# EAGLE design PSPS_AVNC_MITCH_2021-02-25 (EAGLE 9.6.2)

## Sheet 1 of 2
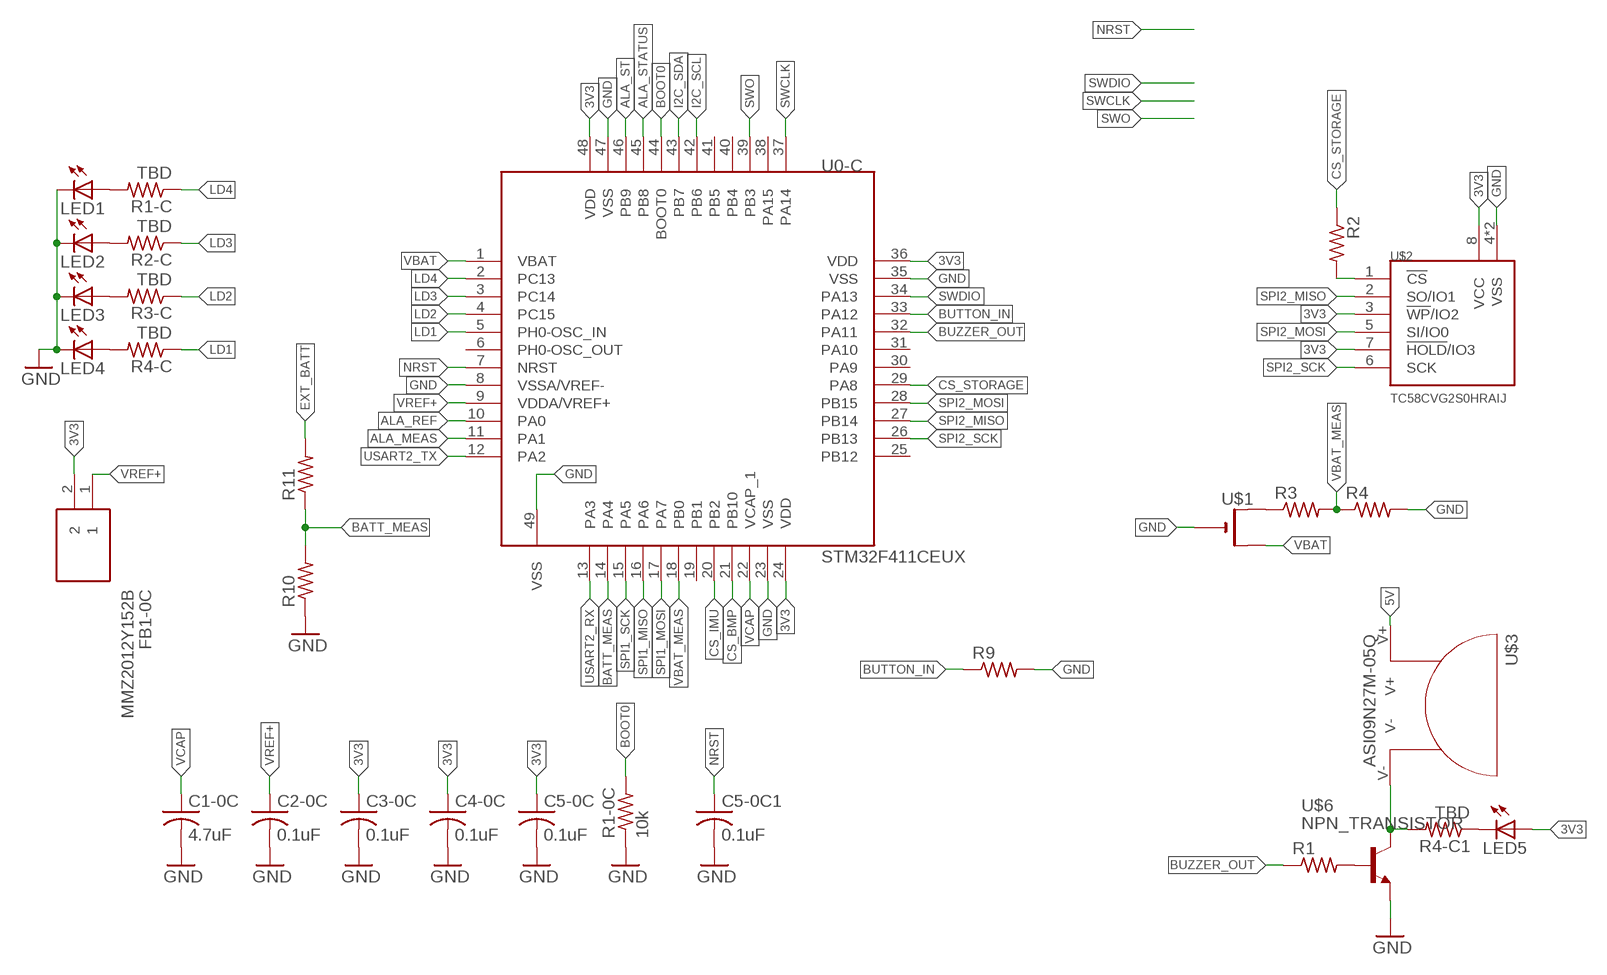
[diagram p0: schematic, sheet 1]

### Parts
C1-0C  4.7uF  C-USC0805  [C0805]
C2-0C  0.1uF  C-USC0805  [C0805]
C3-0C  0.1uF  C-USC0805  [C0805]
C4-0C  0.1uF  C-USC0805  [C0805]
C5-0C  0.1uF  C-USC0805  [C0805]
C5-0C1  0.1uF  C-USC0805  [C0805]
FB1-0C  MMZ2012Y152B  [BEADC2012X105N]
LED1  LEDCHIPLED_0805  [CHIPLED_0805]
LED2  LEDCHIPLED_0805  [CHIPLED_0805]
LED3  LEDCHIPLED_0805  [CHIPLED_0805]
LED4  LEDCHIPLED_0805  [CHIPLED_0805]
LED5  LEDCHIPLED_0805  [CHIPLED_0805]
R1  R-US_R0805  [R0805]
R1-0C  10k  R-US_R0805  [R0805]
R1-C  TBD  R-US_R0805  [R0805]
R2  R-US_R0805  [R0805]
R2-C  TBD  R-US_R0805  [R0805]
R3  R-US_R0805  [R0805]
R3-C  TBD  R-US_R0805  [R0805]
R4  R-US_R0805  [R0805]
R4-C  TBD  R-US_R0805  [R0805]
R4-C1  TBD  R-US_R0805  [R0805]
R9  R-US_R0805  [R0805]
R10  R-US_R0805  [R0805]
R11  R-US_R0805  [R0805]
U0-C  STM32F411CEUX  [QFN50P700X700X50-49T560N]
U$1  CR1220SMT  [CR1220-SMD]
U$2  TC58CVG2S0HRAIJ  [SON127P800X600X80-9T350X440N]
U$3  ASI09N27M-05Q  [ASI09N27M-05Q]
U$6  NPN_TRANSISTOR  [SOT23]

### Nets
3V3: C3-0C.1 C4-0C.1 C5-0C.1 FB1-0C.2 LED5.A U0-C.24(VDD) U0-C.36(VDD) U0-C.48(VDD) U$2.3(!WP!/IO2) U$2.7(!HOLD!/IO3) U$2.8(VCC) ; also sheet 2
5V: U$3.V+ ; also sheet 2
ALA_MEAS: U0-C.11(PA1) ; also sheet 2
ALA_REF: U0-C.10(PA0) ; also sheet 2
ALA_ST: U0-C.46(PB9) ; also sheet 2
ALA_STATUS: U0-C.45(PB8) ; also sheet 2
BATT_MEAS: R10.2 R11.1 U0-C.14(PA4)
BOOT0: R1-0C.2 U0-C.44(BOOT0)
BUTTON_IN: R9.1 U0-C.33(PA12)
BUZZER_OUT: R1.1 U0-C.32(PA11)
CS_BMP: U0-C.21(PB10) ; also sheet 2
CS_IMU: U0-C.20(PB2) ; also sheet 2
CS_STORAGE: R2.1 U0-C.29(PA8)
CS_STORAGE-VIA: R2.2 U$2.1(!CS!)
EXT_BATT: R11.2
GND: C1-0C.2 C2-0C.2 C3-0C.2 C4-0C.2 C5-0C1.2 C5-0C.2 LED1.C LED2.C LED3.C LED4.C R1-0C.1 R4.2 R9.2 R10.1 U0-C.8(VSSA/VREF-) U0-C.23(VSS) U0-C.35(VSS) U0-C.47(VSS) U0-C.49(VSS) U$1.- U$2.4(VSS) U$2.9(VSS) U$6.3(E) ; also sheet 2
I2C_SCL: U0-C.42(PB6)
I2C_SDA: U0-C.43(PB7)
LD1: R4-C.1 U0-C.5(PH0-OSC_IN)
LD2: R3-C.1 U0-C.4(PC15)
LD3: R2-C.1 U0-C.3(PC14)
LD4: R1-C.1 U0-C.2(PC13)
N$1: R1.2 U$6.1(B)
N$2: LED4.A R4-C.2
N$3: LED3.A R3-C.2
N$4: LED2.A R2-C.2
N$5: LED1.A R1-C.2
N$10: R3.1 U$1.+$1(+)
N$11: R4-C1.2 U$3.V- U$6.2(C)
N$14: LED5.C R4-C1.1
NRST: C5-0C1.1 U0-C.7(NRST)
SPI1_MISO: U0-C.16(PA6) ; also sheet 2
SPI1_MOSI: U0-C.17(PA7) ; also sheet 2
SPI1_SCK: U0-C.15(PA5) ; also sheet 2
SPI2_MISO: U0-C.27(PB14) U$2.2(SO/IO1)
SPI2_MOSI: U0-C.28(PB15) U$2.5(SI/IO0)
SPI2_SCK: U0-C.26(PB13) U$2.6(SCK)
SWCLK: U0-C.37(PA14)
SWDIO: U0-C.34(PA13)
SWO: U0-C.39(PB3)
USART2_RX: U0-C.13(PA3) ; also sheet 2
USART2_TX: U0-C.12(PA2) ; also sheet 2
VBAT: U0-C.1(VBAT) U$1.+$2(+1) ; also sheet 2
VBAT_MEAS: R3.2 R4.1 U0-C.18(PB0)
VCAP: C1-0C.1 U0-C.22(VCAP_1)
VREF+: C2-0C.1 FB1-0C.1 U0-C.9(VDDA/VREF+)
Unconnected: U0-C.6(PH0-OSC_OUT) U0-C.19(PB1) U0-C.25(PB12) U0-C.30(PA9) U0-C.31(PA10) U0-C.38(PA15) U0-C.40(PB4) U0-C.41(PB5)

## Sheet 2 of 2
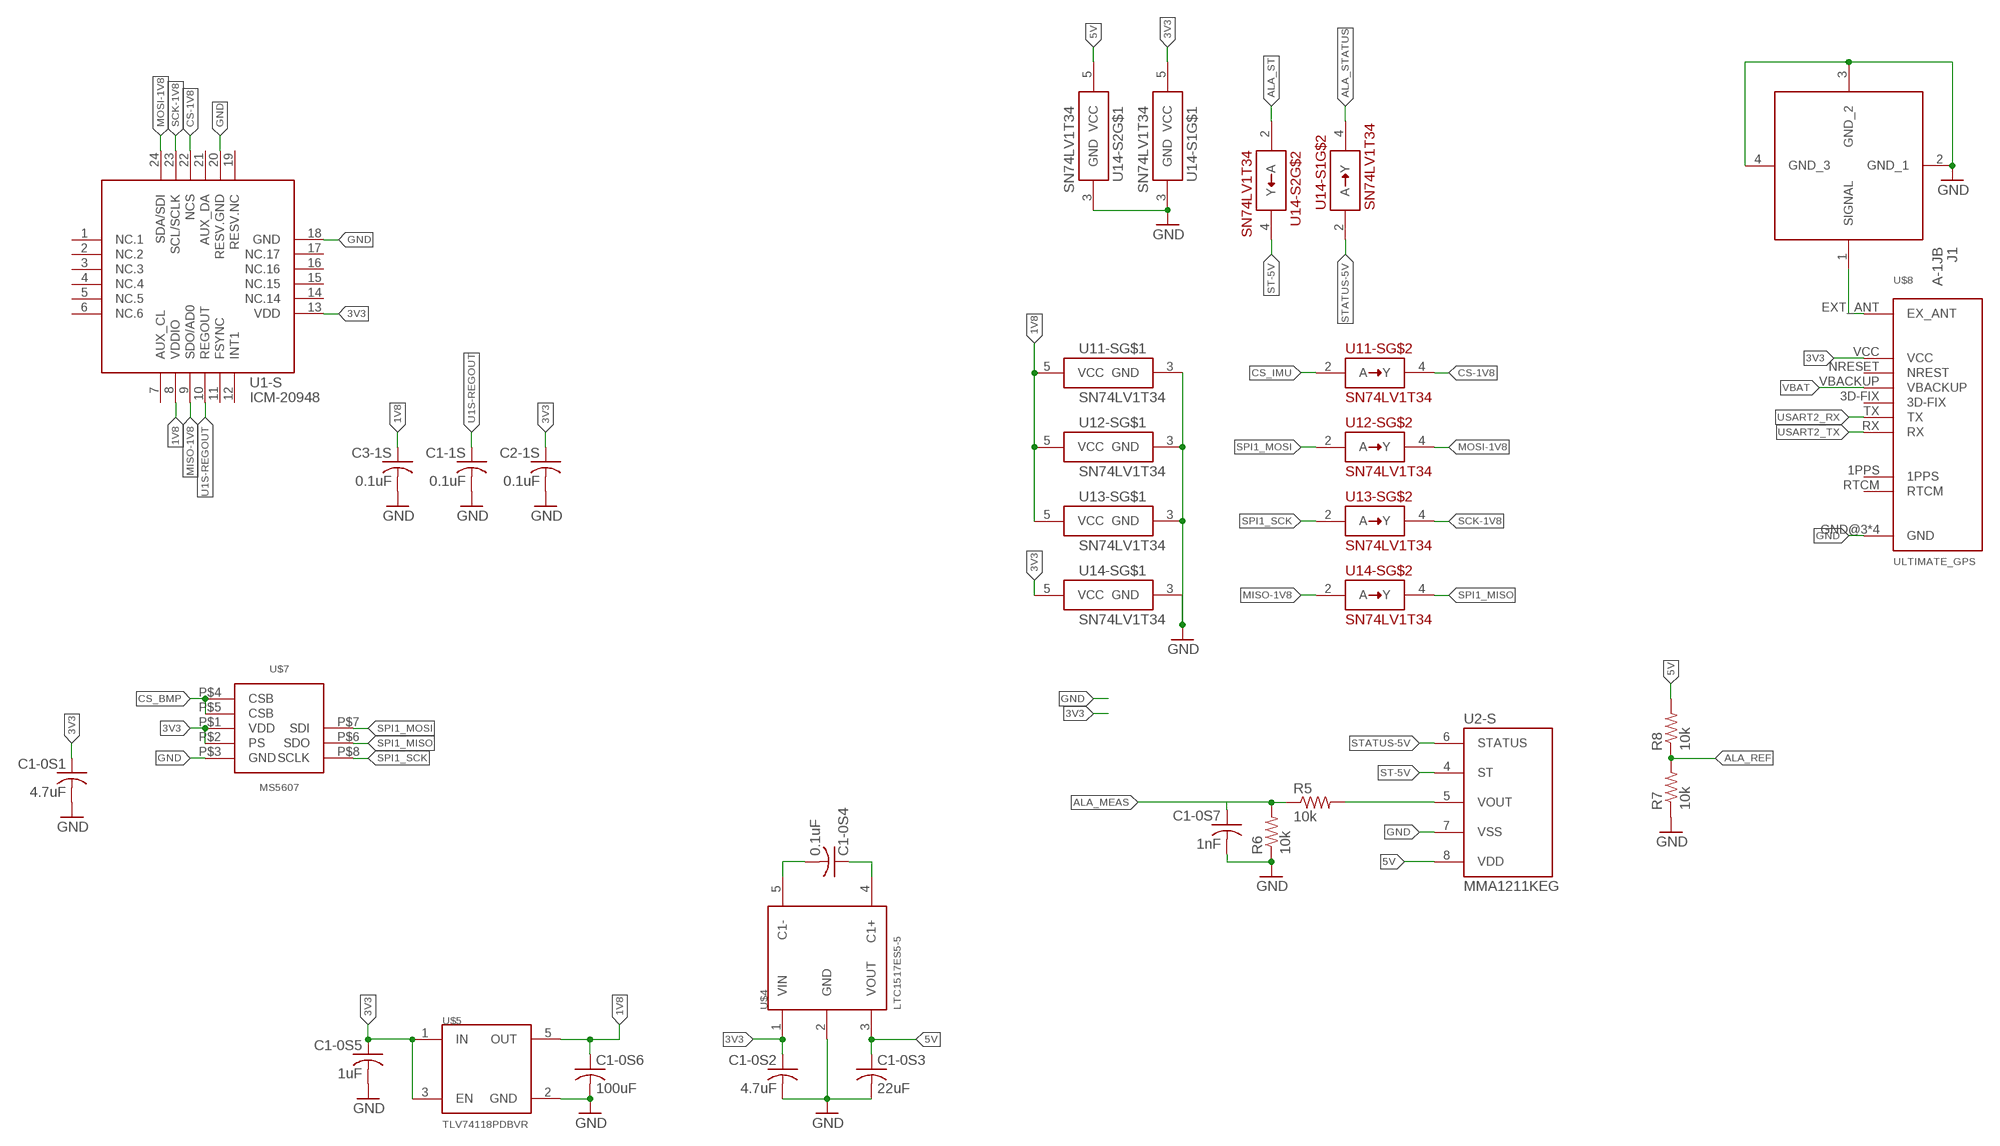
[diagram p1: schematic, sheet 2]

### Parts
C1-0S1  4.7uF  C-USC0805  [C0805]
C1-0S2  4.7uF  C-USC0805  [C0805]
C1-0S3  22uF  C-USC0805  [C0805]
C1-0S4  0.1uF  C-USC0805  [C0805]
C1-0S5  1uF  C-USC0805  [C0805]
C1-0S6  100uF  C-USC0805  [C0805]
C1-0S7  1nF  C-USC0805  [C0805]
C1-1S  0.1uF  C-USC0805  [C0805]
C2-1S  0.1uF  C-USC0805  [C0805]
C3-1S  0.1uF  C-USC0805  [C0805]
J1  A-1JB  [A1JB]
R5  10k  R-US_R0805  [R0805]
R6  10k  R-US_R0805  [R0805]
R7  10k  R-US_R0805  [R0805]
R8  10k  R-US_R0805  [R0805]
U1-S  ICM-20948  [QFN40P300X300X105-25T159X175]
U2-S  MMA1211KEG  [SOIC127P1041X355-16N]
U11-S  SN74LV1T34  [SOT65P210X110-5]
U12-S  SN74LV1T34  [SOT65P210X110-5]
U13-S  SN74LV1T34  [SOT65P210X110-5]
U14-S  SN74LV1T34  [SOT65P210X110-5]
U14-S1  SN74LV1T34  [SOT65P210X110-5]
U14-S2  SN74LV1T34  [SOT65P210X110-5]
U$4  LTC1517ES5-5  [SOT95P280X145-5N]
U$5  TLV74118PDBVR  [SOT95P280X145-5N]
U$7  MS5607  [MS5607]
U$8  ULTIMATE_GPS  [FGPMMOPA6H]

### Nets
1V8: C1-0S6.1 C3-1S.1 U1-S.8(VDDIO) U11-S.5(VCC) U12-S.5(VCC) U13-S.5(VCC) U$5.5(OUT)
3V3: C1-0S1.1 C1-0S2.1 C1-0S5.1 C2-1S.1 U1-S.13(VDD) U14-S1.5(VCC) U14-S.5(VCC) U$4.1(VIN) U$5.1(IN) U$5.3(EN) U$7.P$1(VDD) U$7.P$2(PS) U$8.VCC ; also sheet 1
5V: C1-0S3.1 R8.2 U2-S.8(VDD) U14-S2.5(VCC) U$4.3(VOUT) ; also sheet 1
ALA_MEAS: C1-0S7.1 R5.1 R6.2 ; also sheet 1
ALA_REF: R7.2 R8.1 ; also sheet 1
ALA_ST: U14-S2.2(A) ; also sheet 1
ALA_STATUS: U14-S1.4(Y) ; also sheet 1
CS-1V8: U1-S.22(NCS) U11-S.4(Y)
CS_BMP: U$7.P$4(CSB) U$7.P$5(CSB) ; also sheet 1
CS_IMU: U11-S.2(A) ; also sheet 1
GND: C1-0S1.2 C1-0S2.2 C1-0S3.2 C1-0S5.2 C1-0S6.2 C1-0S7.2 C1-1S.2 C2-1S.2 C3-1S.2 J1.2(GND_1) J1.3(GND_2) J1.4(GND_3) R6.1 R7.1 U1-S.18(GND) U1-S.20(RESV.GND) U2-S.7(VSS) U11-S.3(GND) U12-S.3(GND) U13-S.3(GND) U14-S1.3(GND) U14-S2.3(GND) U14-S.3(GND) U$4.2(GND) U$5.2(GND) U$7.P$3(GND) U$8.GND@3(GND) U$8.GND@8(GND) U$8.GND@12(GND) U$8.GND@19(GND) ; also sheet 1
MISO-1V8: U1-S.9(SDO/AD0) U14-S.2(A)
MOSI-1V8: U1-S.24(SDA/SDI) U12-S.4(Y)
N$12: C1-0S4.1 U$4.4(C1+)
N$13: C1-0S4.2 U$4.5(C1-)
N$15: J1.1(SIGNAL) U$8.EXT_ANT(EX_ANT)
N$16: R5.2 U2-S.5(VOUT)
SCK-1V8: U1-S.23(SCL/SCLK) U13-S.4(Y)
SPI1_MISO: U14-S.4(Y) U$7.P$6(SDO) ; also sheet 1
SPI1_MOSI: U12-S.2(A) U$7.P$7(SDI) ; also sheet 1
SPI1_SCK: U13-S.2(A) U$7.P$8(SCLK) ; also sheet 1
ST-5V: U2-S.4(ST) U14-S2.4(Y)
STATUS-5V: U2-S.6(STATUS) U14-S1.2(A)
U1S-REGOUT: C1-1S.1 U1-S.10(REGOUT)
USART2_RX: U$8.TX ; also sheet 1
USART2_TX: U$8.RX ; also sheet 1
VBAT: U$8.VBACKUP ; also sheet 1
Unconnected: U1-S.1(NC.1) U1-S.2(NC.2) U1-S.3(NC.3) U1-S.4(NC.4) U1-S.5(NC.5) U1-S.6(NC.6) U1-S.7(AUX_CL) U1-S.11(FSYNC) U1-S.12(INT1) U1-S.14(NC.14) U1-S.15(NC.15) U1-S.16(NC.16) U1-S.17(NC.17) U1-S.19(RESV.NC) U1-S.21(AUX_DA) U$8.1PPS U$8.3D-FIX U$8.NRESET(NREST) U$8.RTCM

## Library data of the parts
C1-0C C1-0S1-C1-0S7 C1-1S C2-0C C2-1S C3-0C C3-1S C4-0C C5-0C C5-0C1 = resistor:C-US: CAPACITOR, American symbol
FB1-0C = Computer2:MMZ2012Y152B: Ferrite bead SMD 1500Ohm 500mA TDK Ferrite Bead (Chip Bead), 2 x 1.25 x 0.85mm (0805) Source: Datasheet <https://componentsearchengine.com/Datasheets/1/MMZ2012Y152B.pdf>; DESCRIPTION: Ferrite bead SMD 1500Ohm 500mA TDK Ferrite Bead (Chip Bead), 2 x 1.25 x 0.85mm (0805); HEIGHT: 1.05mm; MANUFACTURER_NAME: TDK; MANUFACTURER_PART_NUMBER: MMZ2012Y152B; MOUSER_PART_NUMBER: 810-MMZ2012Y152B; MOUSER_PRICE-STOCK: https://www.mouser.com/Search/Refine.aspx?Keyword=810-MMZ2012Y152B
J1 = SamacSys_Parts:A-1JB: AMC Straight PCB Jack, Surface Mount Source: Datasheet <https://componentsearchengine.com/Datasheets/1/A-1JB.pdf>; DESCRIPTION: AMC Straight PCB Jack, Surface Mount; HEIGHT: 1.05mm; MANUFACTURER_NAME: Amphenol; MANUFACTURER_PART_NUMBER: A-1JB; MOUSER_PART_NUMBER: 523-A-1JB; MOUSER_PRICE-STOCK: https://www.mouser.com/Search/Refine.aspx?Keyword=523-A-1JB
LED1-LED5 = adafruit:LED: LED OSRAM: - CHIPLED LG R971, LG N971, LY N971, LG Q971, LY Q971, LO R971, LY R971 LH N974, LH R974 LS Q976, LO Q976, LY Q976 LO Q996 - Hyper CHIPLED LW Q18S LB Q993, LB Q99A, LB R99A - SideLED LS A670, LO A670, LY A670, LG A670, LP A670 LB A673, LV A673, LT A673, LW A673 LH A674 LY A675 LS A676, LA A676, LO A676, LY A676, LW A676 LS A679, LY A679, LG A679 - Hyper Micro SIDELED® LS Y876, LA Y876, LO Y876, LY Y876 LT Y87S - SmartLED LW L88C, LW L88S LB L89C, LB L89S, LG L890 LS L89K, LO L89K, LY L89K LS L896, LA L896, LO L896, LY L896 - TOPLED LS T670, LO T670, LY T670, LG T670, LP T670 LSG T670, LSP T670, LSY T670, LOP T670, LYG T670 LG T671, LOG T671, LSG T671 LB T673, LV T673, LT T673, LW T673 LH T674 LS T676, LA T676, LO T676, LY T676, LB T676, LH T676, LSB T676, LW T676 LB T67C, LV T67C, LT T67C, LS T67K, LO T67K, LY T67K, LW E67C LS E67B, LA E67B, LO E67B, LY E67B, LB E67C, LV E67C, LT E67C LW T67C LS T679, LY T679, LG T679 LS T770, LO T770, LY T770, LG T770, LP T770 LB T773, LV T773, LT T773, LW T773 LH T774 LS E675, LA E675, LY E675, LS T675 LS T776, LA T776, LO T776, LY T776, LB T776 LHGB T686 LT T68C, LB T68C - Hyper Mini TOPLED® LB M676 - Mini TOPLED Santana® LG M470 LS M47K, LO M47K, LY M47K Source: http://www.osram.convergy.de/
R1 R1-0C R1-C R2 R2-C R3 R3-C R4 R4-C R4-C1 R5-R11 = resistor:R-US_: RESISTOR, American symbol
U0-C = Computer2:STM32F411CEUX: STM32F411CEUx https://www.mouser.com/ProductDetail/STMicroelectronics/STM32F411CEU7/?qs=k5OWtXsTJaprF2FuhgNRlw%3D%3D
U1-S = Computer2:ICM-20948: 9 Axis Motion Sensor from TDK InvenSense https://store.invensense.com/products/detail/ICM20948-InvenSense/597203/
U2-S = Computer2:MMA1211KEG
U11-S U12-S U13-S U14-S U14-S1 U14-S2 = Computer2:SN74LV1T34: Single Power Supply BUFFER Logic Level Shifter
U$1 = adafruit:CR1220: CR1216/CR1220/CR1225 12mm 3V lithium coin cell Great for battery packup. Both SMT and THM holders. Note the THM package has the ground pads on both sides of the PCB so that the masks are the same - this reduces the cost
U$2 = Computer2:TC58CVG2S0HRAIJ: KIOXIA 4Gb 3.3V Serial Interface NAND Storage Chip https://www.mouser.com/ProductDetail/Kioxia-America/TC58CVG2S0HRAIJ/?qs=%2Fha2pyFadugZc7%252BD9PrBDvjJY1X%2FOab4zY0dVt2Ql9dEVkAi3P74yw%3D%3D
U$3 = Computer2:ASI09N27M-05Q
U$4 = Computer2:LTC1517ES5-5: Micropower, Regulated 5V Charge Pump in a 5-Pin SOT-23 Package https://www.mouser.com/ProductDetail/Analog-Devices/LTC1517ES5-5TRPBF/?qs=hVkxg5c3xu9WXQi7ay6esQ%3D%3D
U$5 = Computer2:TLV74118PDBVR: TLV741P 150-mA, Low-Dropout Regulator With Foldback Current Limit https://www.mouser.com/ProductDetail/Texas-Instruments/TLV74118PDBVR?qs=EU6FO9ffTwcK4Aqp8%2FfrLA%3D%3D
U$6 = Computer2:NPN_TRANSISTOR
U$7 = Computer2:MS5607
U$8 = Computer2:ULTIMATE_GPS

## Board
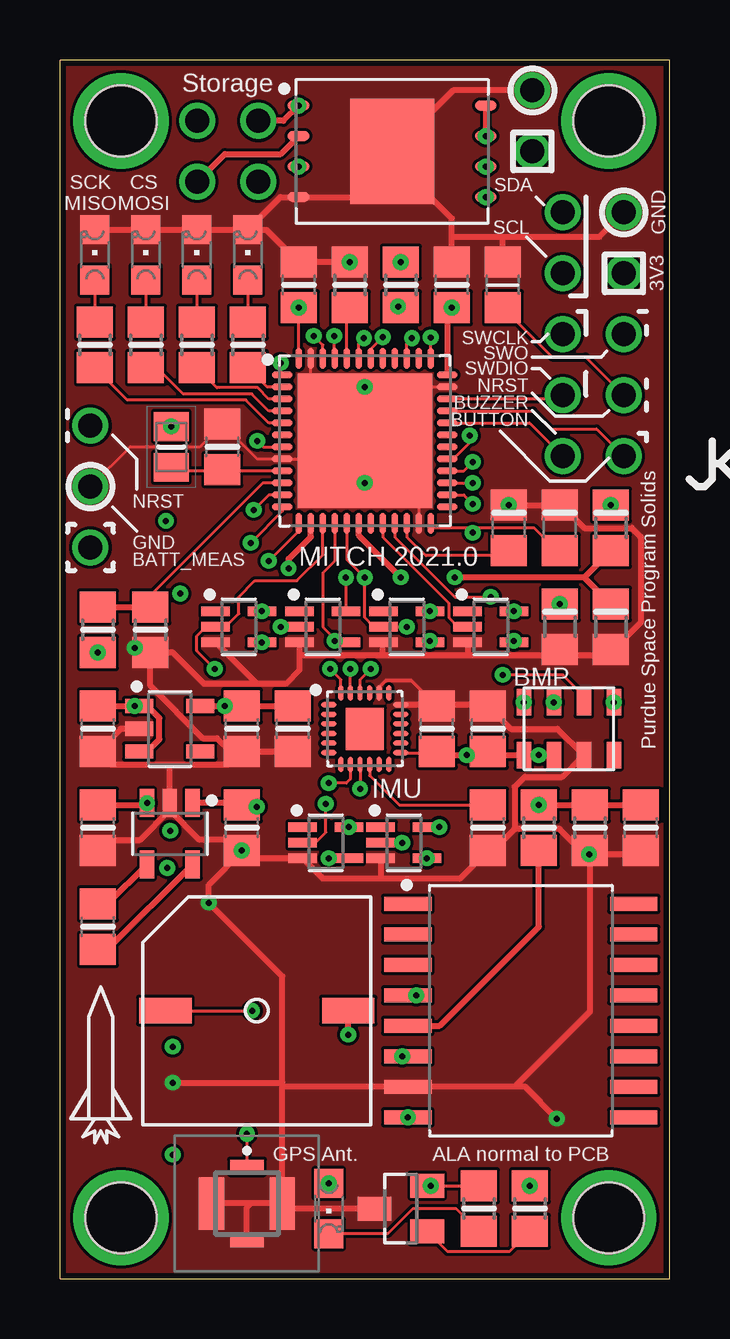
[diagram p2: board, top side]
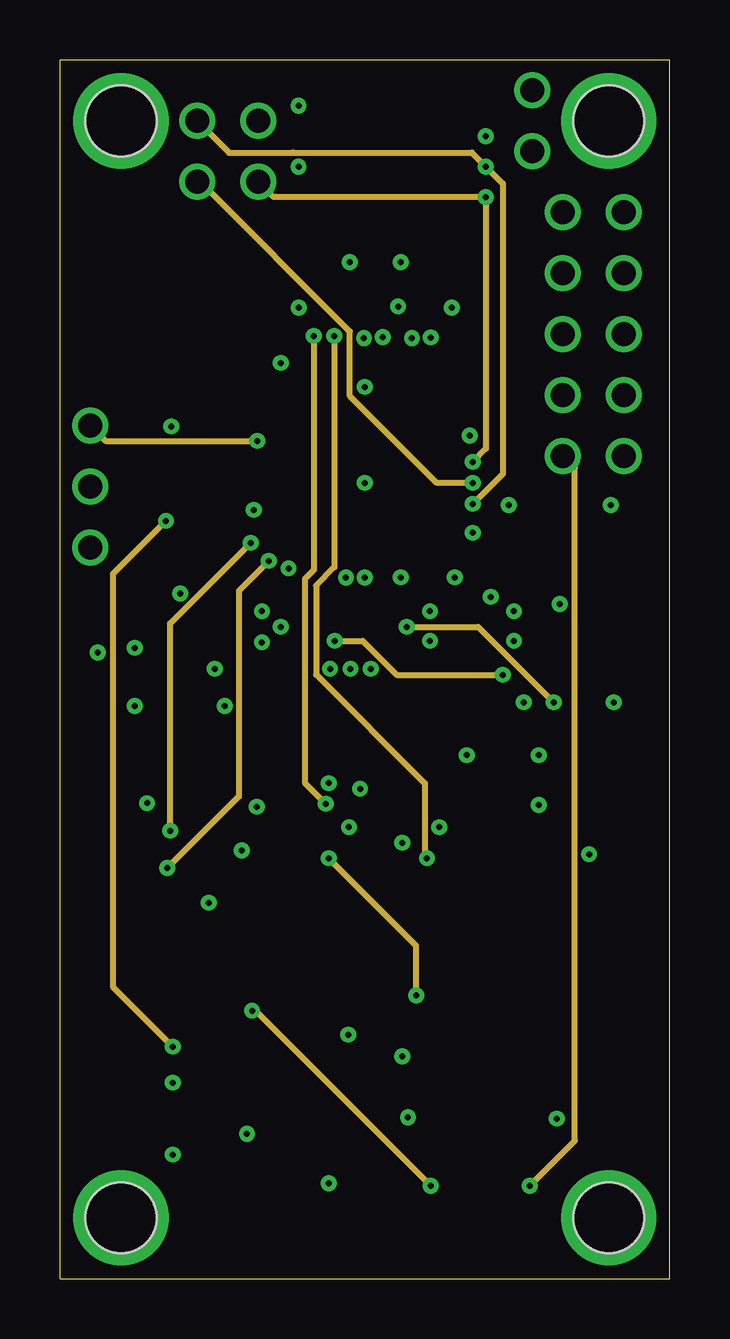
[diagram p3: board, inner layer Route2]
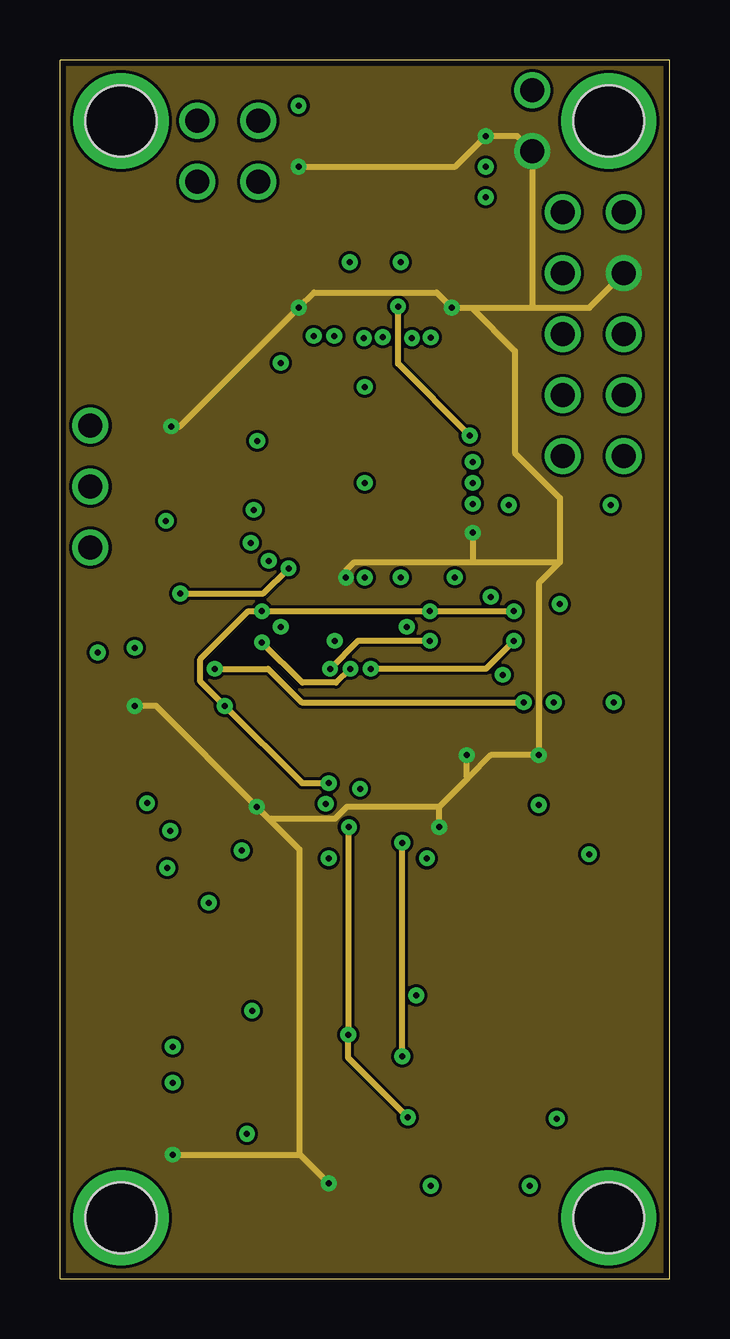
[diagram p4: board, inner layer Route15]
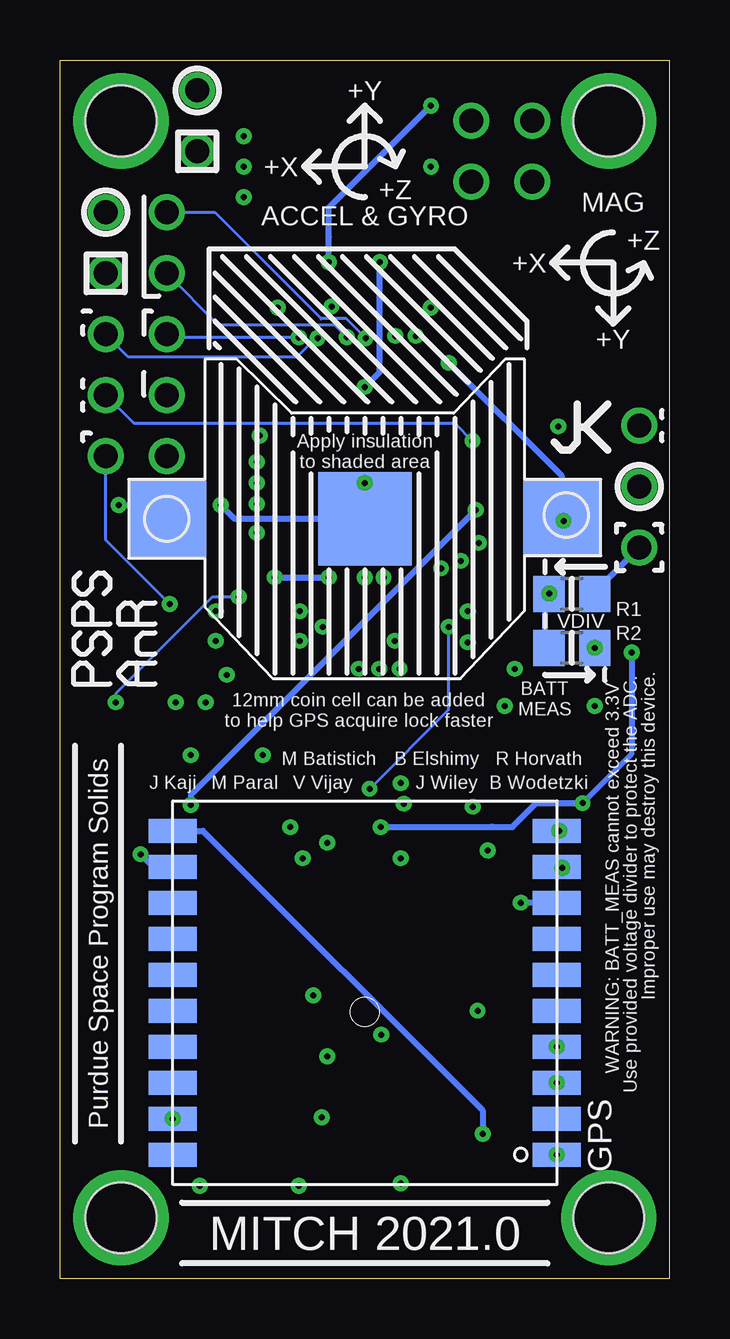
[diagram p5: board, bottom side, seen from below]

Size 25.4 x 50.8 mm. Coordinates in mm from the lower left corner, seen from the top.
Outline: 0,0 25.4,0 25.4,50.8 0,50.8 0,0
Copper layers (1+2*15+16): Top 0.035mm / dielectric 1.5mm / Route2 0.035mm / dielectric 0.15mm / Route15 0.035mm / dielectric 0.2mm / Bottom 0.035mm
Design rules "default *": minimum track width 5mil, minimum drill 0.25mm, track to track 5mil, track to pad 5mil, pad to pad 5mil, via to via 5mil, smd to smd 5mil, copper to edge 10mil, drill to drill 5mil, minimum pad ring 10mil, minimum via ring 8mil, stop-mask expansion 4mil, vias tented up to drill 0mil, thermal gap 10mil
Holes 2.95 mm at 2.54,2.54 22.86,2.54 22.86,48.26 2.54,48.26

### Footprints (pad centres in the part's own frame; a part is rotated, then mirrored left to right if it is on the bottom)
C0805 = smd 1.3 x 1.5: 1 -0.95,0; 2 0.95,0
BEADC2012X105N = smd 1.2 x 1.45: 1 -0.85,0; 2 0.85,0
A1JB = smd 0.6 x 1.4: 1 1.525,0; 3 -1.525,0 | smd 2.2 x 1.05: 2 0,1.475; 4 0,-1.475
CHIPLED_0805 = smd 1.2 x 1.2: A 0,-1.05; C 0,1.05
R0805 = smd 1.3 x 1.5: 1 -0.95,0; 2 0.95,0
QFN50P700X700X50-49T560N = smd 0.86 x 0.27: 1 -3.435,2.75; 2 -3.435,2.25; 3 -3.435,1.75; 4 -3.435,1.25; 5 -3.435,0.75; 6 -3.435,0.25; 7 -3.435,-0.25; 8 -3.435,-0.75; 9 -3.435,-1.25; 10 -3.435,-1.75; 11 -3.435,-2.25; 12 -3.435,-2.75; 25 3.435,-2.75; 26 3.435,-2.25; 27 3.435,-1.75; 28 3.435,-1.25; 29 3.435,-0.75; 30 3.435,-0.25; 31 3.435,0.25; 32 3.435,0.75; 33 3.435,1.25; 34 3.435,1.75; 35 3.435,2.25; 36 3.435,2.75 | smd 0.27 x 0.86: 13 -2.75,-3.435; 14 -2.25,-3.435; 15 -1.75,-3.435; 16 -1.25,-3.435; 17 -0.75,-3.435; 18 -0.25,-3.435; 19 0.25,-3.435; 20 0.75,-3.435; 21 1.25,-3.435; 22 1.75,-3.435; 23 2.25,-3.435; 24 2.75,-3.435; 37 2.75,3.435; 38 2.25,3.435; 39 1.75,3.435; 40 1.25,3.435; 41 0.75,3.435; 42 0.25,3.435; 43 -0.25,3.435; 44 -0.75,3.435; 45 -1.25,3.435; 46 -1.75,3.435; 47 -2.25,3.435; 48 -2.75,3.435 | smd 5.6 x 5.6: 49 0,0
QFN40P300X300X105-25T159X175 = smd 0.635 x 0.203: 1 -1.496,1; 2 -1.496,0.6; 3 -1.496,0.2; 4 -1.496,-0.2; 5 -1.496,-0.6; 6 -1.496,-1; 13 1.496,-1; 14 1.496,-0.6; 15 1.496,-0.2; 16 1.496,0.2; 17 1.496,0.6; 18 1.496,1 | smd 0.203 x 0.635: 7 -1,-1.496; 8 -0.6,-1.496; 9 -0.2,-1.496; 10 0.2,-1.496; 11 0.6,-1.496; 12 1,-1.496; 19 1,1.496; 20 0.6,1.496; 21 0.2,1.496; 22 -0.2,1.496; 23 -0.6,1.496; 24 -1,1.496 | smd 1.59 x 1.75: 25 0,0
SOIC127P1041X355-16N = smd 1.973 x 0.589: 1 -4.705,4.445; 2 -4.705,3.175; 3 -4.705,1.905; 4 -4.705,0.635; 5 -4.705,-0.635; 6 -4.705,-1.905; 7 -4.705,-3.175; 8 -4.705,-4.445; 9 4.705,-4.445; 10 4.705,-3.175; 11 4.705,-1.905; 12 4.705,-0.635; 13 4.705,0.635; 14 4.705,1.905; 15 4.705,3.175; 16 4.705,4.445
SOT65P210X110-5 = smd 1.186 x 0.397: 1 -0.962,0.65; 2 -0.962,0; 3 -0.962,-0.65; 4 0.962,-0.65; 5 0.962,0.65
CR1220-SMD = smd 3.2 x 3.2: +$1 -8.2,0; +$2 8.2,0 | smd 3.9 x 3.9: - 0,0
SON127P800X600X80-9T350X440N = smd 0.911 x 0.42: 1 -3.901,1.905; 2 -3.901,0.635; 3 -3.901,-0.635; 4 -3.901,-1.905; 5 3.901,-1.905; 6 3.901,-0.635; 7 3.901,0.635; 8 3.901,1.905 | smd 3.5 x 4.4: 9 0,0
ASI09N27M-05Q = smd 2.184 x 1.067: V+ 3.81,0; V- -3.81,0
SOT95P280X145-5N = smd 1.165 x 0.597: 1 -1.275,0.95; 2 -1.275,0; 3 -1.275,-0.95; 4 1.275,-0.95; 5 1.275,0.95
SOT23 = smd 1 x 1.4: 1 -0.95,-1.1; 2 0.95,-1.1; 3 0,1.1
MS5607 = smd 1.1 x 0.6: P$1 -1.1,1.875; P$2 -1.1,0.625; P$3 -1.1,-0.625; P$4 -1.1,-1.875; P$5 1.1,-1.875; P$6 1.1,-0.625; P$7 1.1,0.625; P$8 1.1,1.875
FGPMMOPA6H = smd 2 x 1: 1PPS 8,-3.75; 3D-FIX -8,0.75; EXT_ANT 8,-6.75; GND@3 -8,3.75; GND@8 -8,-3.75; GND@12 8,-5.25; GND@19 8,5.25; NC@6 -8,-0.75; NC@7 -8,-2.25; NC@15 8,-0.75; NC@16 8,0.75; NC@17 8,2.25; NC@18 8,3.75; NC@20 8,6.75; NRESET -8,5.25; RTCM 8,-2.25; RX -8,-6.75; TX -8,-5.25; VBACKUP -8,2.25; VCC -8,6.75

### Placement (x,y rotation side)
C1-0C  18.7,31.3 90 top
C1-0S1  17.82,22.92 90 top
C1-0S2  7.57,18.8 270 top
C1-0S3  1.57,18.8 270 top
C1-0S4  1.57,14.67 270 top
C1-0S5  1.57,22.92 270 top
C1-0S6  7.57,22.92 270 top
C1-0S7  24.2,18.8 270 top
C1-1S  17.82,18.8 270 top
C2-0C  6.76,34.67 90 top
C2-1S  15.7,22.92 90 top
C3-0C  20.82,31.3 90 top
C3-1S  9.7,22.92 270 top
C4-0C  16.32,41.42 90 top
C5-0C  9.95,41.42 90 top
C5-0C1  18.45,41.42 90 top
FB1-0C  4.64,34.67 90 top
J1  7.79,3.13 90 top
LED1  7.82,42.67 0 top
LED2  5.7,42.67 0 top
LED3  3.57,42.67 0 top
LED4  1.45,42.67 0 top
LED5  11.2,2.92 180 top
R1  19.57,2.92 270 top
R1-0C  12.07,41.42 270 top
R1-C  7.82,38.92 90 top
R2  14.2,41.42 90 top
R2-C  5.7,38.92 90 top
R3  22.95,31.3 270 top
R3-C  3.57,38.92 90 top
R4  22.95,27.17 270 top
R4-C  1.45,38.92 90 top
R4-C1  17.45,2.92 90 top
R5  19.95,18.8 270 top
R6  22.07,18.8 90 top
R7  3.76,27.05 90 top
R8  1.57,27.05 270 top
R9  20.82,27.17 270 top
R10  4.07,26.3 180 bottom
R11  4.07,28.55 0 bottom
U0-C  12.7,34.92 0 top
U1-S  12.7,22.92 0 top
U2-S  19.2,11.17 0 top
U11-S  17.95,27.17 0 top
U12-S  14.45,27.17 0 top
U13-S  7.45,27.17 0 top
U14-S  10.95,27.17 0 top
U14-S1  14.32,18.17 0 top
U14-S2  11.07,18.17 0 top
U$1  12.7,31.67 0 bottom
U$2  13.84,46.99 0 top
U$3  8.2,11.17 0 top
U$4  4.57,18.55 270 top
U$5  4.57,22.92 0 top
U$6  14.2,2.92 90 top
U$7  21.2,22.92 90 top
U$8  12.7,11.92 180 bottom

### Tracks (layer width: path | path; a pad name or v marks a point on that pad's centre or on a via)
1V8  (via drill 0.25)
  Top 0.127: U1-S.8 12.1,20.82 11.93,20.66 v11.2,20.66
  Top 0.254: C3-1S.1 C1-0S6.1 v6.87,23.87 U$5.5
  Route15 0.254: v11.2,20.66 10.48,20.66 10.09,20.66 v6.87,23.87 5.85,24.89 5.85,25.82 7.85,27.82 U13-S.5 U12-S.5 U11-S.5
  other vias: 8.41,27.82 15.41,27.82 18.91,27.82
3V3  (via drill 0.25, 1)
  Top 0.127: 15.45,31.17 U0-C.24 15.51,31.42 15.51,31.28 17.2,31.28 | U0-C.48 9.93,38.38 9.95,38.4 C5-0C.1 | 16.5,37.67 U0-C.36 | v19.95,21.82 U$7.P$1 17.98,21.82 | 17.98,21.82 C1-0S1.1 | U1-S.13 15.7,21.92 | 17.96,21.82 17.98,21.82 | v11.92,29.22 U14-S.5 | C3-0C.1 20.7,30.35 19.77,31.28 17.2,31.28 | v17.2,31.09 17.2,31.28
  Top 0.254: U$2.8 U$2.7 | U$5.3 3.62,21.97 4.14,22.49 4.14,23.36 3.62,23.87 U$5.1 v3.12,23.87 C1-0S5.1 | U$7.P$2 v19.95,21.82 17.96,21.82 v16.95,21.82 15.85,21.82 C2-1S.1 15.7,21.92 | U14-S1.5 v15.81,18.82 | 16.38,40.42 C4-0C.1 16.13,40.28 U0-C.36 | C3-0C.1 20.82,29.87 | C1-0S2.1 7.5,19.82 U$4.1 | 7.5,19.8 C1-0S2.1 | C1-0S2.1 8.12,19.75 v8.2,19.67
  Route15 0.254: 10,5.17 9.97,5.2 9.97,17.9 8.7,19.17 | 10,5.17 LED5.A | v15.81,18.82 15.81,19.67 | 15.81,19.67 11.95,19.67 11.45,19.17 8.7,19.17 | 17,20.87 17.96,21.82 v19.95,21.82 19.95,28.99 20.82,29.87 | 17,20.87 15.81,19.67 | U$2.3 16.47,46.35 U$2.7 19.05,47.62 v19.68,46.99 19.68,40.49 19.7,40.47 | 17,20.87 16.95,20.92 v16.95,21.82 | 17.2,29.87 12.27,29.87 11.92,29.52 v11.92,29.22 | 17.2,29.87 20.82,29.87 | 20.82,29.87 20.82,32.55 18.95,34.42 18.95,38.67 17.15,40.47 | v17.2,31.09 17.2,29.87 | 17.15,40.47 C4-0C.1 15.69,41.11 10.59,41.11 C5-0C.1 5,35.52 FB1-0C.2 | v23.49,41.91 22.06,40.47 19.7,40.47 | 17.15,40.47 19.7,40.47 | 8.17,19.65 v8.2,19.67 | v3.12,23.87 4,23.87 v8.2,19.67 | v8.2,19.67 8.7,19.17 | U$8.VCC 10,5.17
  other vias: 11.2,3.97 4.7,5.17 9.95,40.47 9.94,46.35 17.74,47.62 4.64,35.52 16.32,40.47
  pour Route15 (no thermals): 0.2,50.67 0.2,0.17 25.2,0.17 25.2,50.67
5V  (via drill 0.25)
  Top 0.254: 13.64,6.73 U2-S.8 | 11.07,11.36 11.26,11.17 U$3.V+ v12.01,10.17 | 3.6,19.8 U$4.3 3.55,19.75 C1-0S3.1 1.65,19.82 1.68,19.8
  Route15 0.254: U2-S.8 12.01,9.21 v12.01,10.17 12.01,18.8 U14-S2.5
  Bottom 0.203: U$4.3 1.57,21.87 1.57,22.17
  Bottom 0.254: R8.2 1.57,22.17 | U14-S2.5 7.45,18.82 7.35,18.82 6.55,18.82 5.55,19.82 U$4.3
  other vias: 12.04,18.82 14.5,6.73 1.57,26.1 3.62,19.83
ALA_MEAS  (via drill 0.25)
  Top 0.127: U0-C.11 8.7,32.67 v8.07,32.05
  Top 0.254: R5.1 R6.2 C1-0S7.1
  Bottom 0.254: 19.95,20.17 | 19.95,20.17 v8.07,32.04 v8.07,32.05 | 19.95,20.17 R5.1
  other vias: 19.95,19.75
ALA_REF
  Top 0.127: U0-C.10 8.45,33.17 3.76,28.49 R7.2
  Top 0.254: R8.1 R7.2
ALA_ST  (via drill 0.25)
  Top 0.127: U0-C.46 10.95,38.92 v10.57,39.3 | 10.61,18.17 U14-S2.2 10.64,18.17 11.07,18.61 v11.07,19.8
  Route2 0.254: v10.57,39.3 10.57,29.55 10.2,29.17 10.2,20.67 v11.07,19.8
ALA_STATUS  (via drill 0.25)
  Top 0.127: U0-C.45 11.43,38.38 v11.43,39.3
  Route2 0.254: U14-S1.4 15.2,17.61 15.2,20.65 10.67,25.18 10.67,28.89 11.43,29.66 v11.43,39.3
  other vias: 15.29,17.52
BATT_MEAS  (via drill 0.25)
  Top 0.254: U0-C.14 10.45,30.92 9.52,30 v9.52,29.61
  Route15 0.254: v5.01,28.56 8.47,28.56 v9.52,29.61
  Bottom 0.152: R11.1 5.2,28.37
  Bottom 0.254: R11.1 v5.01,28.56 | R10.2 5.2,26.47 5.2,28.37
BOOT0
  Top 0.127: R1-0C.2 11.95,40.35 U0-C.44
BUTTON_IN  (via drill 0.25, 1)
  Top 0.127: U0-C.33 19.7,36.17 20.45,35.42 22.36,35.42 v23.49,34.29
  Bottom 0.127: R9.1 23.49,30.79 v23.49,34.29
  other vias: 20.82,28.12
BUZZER_OUT  (via drill 0.25, 1)
  Top 0.127: v20.95,34.29 19.57,35.67 U0-C.32
  Route2 0.254: R1.1 21.45,5.75 21.45,33.79 v20.95,34.29
  other vias: 19.57,3.87
CS-1V8  (via drill 0.25)
  Top 0.127: U1-S.22 12.5,24.97 v12.95,25.42 | U11-S.4 v18.91,26.59
  Route15 0.254: v18.91,26.59 17.75,25.42 v12.95,25.42
CS_BMP  (via drill 0.25)
  Top 0.127: U0-C.21 13.95,30.92 16.45,28.42 v17.95,28.42 | U$7.P$4 U$7.P$5
  Bottom 0.127: v17.95,28.42 19.05,28.42 23.07,24.4 U$7.P$5
  other vias: 23.07,24.02
CS_IMU
  Top 0.127: U0-C.20 13.45,30.91 16.2,28.16 16.2,27.55 16.58,27.17 U11-S.2
CS_STORAGE  (via drill 0.25)
  Top 0.127: 16.42,34.17 U0-C.29 16.39,34.17 17.07,34.86 v17.07,35.15
  Top 0.254: R2.1 14.14,40.47 v14.08,40.53
  Route15 0.254: v17.07,35.15 14.08,38.14 v14.08,40.53
CS_STORAGE-VIA  (via drill 0.25, 1)
  Top 0.254: U$2.1 9.31,48.26 v8.25,48.26
  Bottom 0.254: R2.2 14.2,43.42 14.2,44.17 14.2,44.64 U$2.1
  other vias: 14.2,42.38 9.94,48.89
EXT_BATT  (via drill 1)
  Bottom 0.254: R11.2 3.12,28.62 v1.27,30.48
GND  (via drill 0.25, 1)
  Top 0.127: 6.85,26.52 U13-S.3 | 14.2,23.99 U1-S.18 14.45,23.92 15.45,23.92 15.65,23.92 15.75,23.92 | U0-C.23 14.95,32.67 U0-C.49 | U0-C.49 11.95,34.17 U0-C.8 8.21,34.17 C2-0C.2 5.81,34.67 2.92,34.67 v1.27,33.02 | U0-C.49 10.45,37.17 U0-C.47 | U0-C.35 13.95,37.17 12.7,35.92 U0-C.49 | C1-0S1.2 C2-1S.2 | v12.7,33.17 U0-C.49 | 1.74,22.14 C1-0S5.2 | 7.85,17.57 7.6,17.82 C1-0S2.2 | U14-S1.3
  Top 0.152: U1-S.20 13.3,24.67 13.57,24.94 14.63,24.94 C2-1S.2
  Top 0.254: LED4.C LED3.C LED2.C LED1.C | 13.83,45.02 13.84,45.43 | 13.84,45.43 13.84,46.67 | 13.84,46.67 U$2.9 16.38,49.53 v19.68,49.53 | U13-S.3 8.21,24.8 | 15.45,23.92 17.77,23.92 C1-0S1.2 18.77,22.92 20.73,22.92 U$7.P$3 20.92,20.92 19.37,20.92 18.95,20.5 18.95,18.76 18.95,18.75 | C2-1S.2 15.75,23.92 | 15.65,23.92 14.45,23.92 | C4-0C.2 16.32,43.42 | 16.32,43.42 16.32,44.19 15.15,45.37 | 15.15,45.37 13.84,46.67 | R1-0C.1 C5-0C.2 8.6,43.72 LED1.C | 14.86,45.08 15.15,45.37 | 22.97,43.92 v23.49,44.45 22.47,43.42 18.45,43.42 | 18.45,43.42 16.32,43.42 | C1-0S5.2 2.13,21.42 4.57,21.42 | C1-0S6.2 C3-1S.2 | C1-0S2.2 7.12,18.3 5.81,18.3 4.57,19.53 | 4.57,19.53 U$4.2 4.57,21.42 | C1-0S3.2 2.02,18.3 3.34,18.3 4.57,19.53 | C1-0S6.2 7.02,21.42 4.57,21.42 | 8.95,3.13 J1.4 9.26,8 | 8.95,3.13 7.95,3.13 | 7.95,3.13 J1.2 | J1.3 7.79,2.97 7.95,3.13 | U$6.3 9.16,2.92 8.95,3.13 | 9.26,8.17 9.26,12.61 v6.2,15.67 6.2,16.42 7.6,17.82 | 9.26,8 U2-S.7 18.95,8 | U$8.GND@19 19.38,8 18.95,8 | R7.1 3.76,24.72 5.96,22.53 6.54,22.53 7.09,21.97 C1-0S6.2 | U$5.2 2.52,22.92 1.74,22.14 | R7.1 4.7,26.1 6,24.8 8.21,24.8 | 8.21,24.8 9.4,24.8 9.99,25.39 9.99,26.01 | U0-C.49 v12.7,37.17 | 13.84,45.43 13.49,45.08 U$2.4 9.18,45.08 LED1.C | 18.19,17.85 C1-1S.2 | C1-0S7.2 24.04,17.69 v22.04,17.69 | v22.04,17.69 21.86,17.69 20.8,18.75 18.95,18.75 | v22.04,17.69 22.04,17.82 R6.1 22.07,11.12 18.95,8 | C1-1S.2 18.05,17.85 18.95,18.75 | C1-1S.2 16.65,16.67 13.36,16.67 | 13.36,16.67 10.96,16.67 U14-S2.3 7.9,17.52 7.85,17.57 | U14-S1.3 13.36,16.67 | C5-0C1.2 18.45,43.42 | 9.99,26.01 U14-S.3 | 20.82,26.01 R9.2 | 9.99,26.01 13.45,26.01 | 13.45,26.01 16.99,26.01 | 16.99,26.01 20.82,26.01
  Top 0.254: U11-S.3 16.99,26.01 | 13.45,26.01 13.45,26.52 U12-S.3 | 20.82,26.01 22.73,26.01 R4.2 23.06,26.22 24.2,27.36 24.2,30.92 23.82,31.3 21.84,31.3 20.89,32.25 C3-0C.2 C1-0C.2 | v3.12,26.3 3.32,26.1 R7.1 | U$8.GND@3 9.26,8.17 | 9.26,8.17 9.26,8
  Bottom 0.127: U$1.- v12.7,33.17
  Bottom 0.254: U$1.- 11.95,32.42 | U$8.GND@8 v6.2,15.67 | 12.2,31.67 U$1.- | v12.7,37.17 12.07,37.8 R1-0C.1 | v22.04,17.69 21.52,17.17 U$8.GND@12 | C1-0C.2 18.12,31.67 U$1.- | 3.12,26.59 R10.1 v3.12,26.3
  other vias: 7.57,17.85 20.7,6.67 4.7,8.17 12.07,42.38 18.7,32.25
  pour Top (no thermals): 0.2,50.67 0.2,0.17 25.2,0.17 25.2,50.67
I2C_SCL  (via drill 0.25, 1)
  Top 0.127: U0-C.42 12.95,38.74 v13.45,39.24
  Bottom 0.127: v13.45,39.24 13.96,39.76 18.8,39.76 v20.95,41.91
I2C_SDA  (via drill 0.25, 1)
  Top 0.127: U0-C.43 12.45,38.99 v12.67,39.21
  Bottom 0.127: v12.67,39.21 13.47,40.01 14.51,40.01 18.95,44.45 v20.95,44.45
LD1
  Top 0.127: U0-C.5 8.7,35.67 7.75,36.63 2.8,36.63 R4-C.1
LD2
  Top 0.127: R3-C.1 4.03,37.97 5.12,36.88 7.99,36.88 8.7,36.17 U0-C.4
LD3
  Top 0.127: R2-C.1 6.54,37.13 8.24,37.13 8.7,36.67 U0-C.3
LD4
  Top 0.127: U0-C.2 8.62,37.17 R1-C.1
MISO-1V8  (via drill 0.25)
  Top 0.127: 9.58,27.17 U14-S.2 v9.2,27.17 | U1-S.9 v12.5,20.42
  Bottom 0.127: v12.5,20.42 9.2,23.72 v9.2,27.17
MOSI-1V8  (via drill 0.25)
  Top 0.127: U1-S.24 11.7,24.97 v11.25,25.42 | U12-S.4 v15.41,26.59
  Route15 0.254: v15.41,26.59 12.41,26.59 v11.25,25.42
N$1
  Top 0.127: U$6.1 16.14,1.13 18.73,1.13 R1.2
N$2
  Top 0.127: LED4.A R4-C.2
N$3
  Top 0.127: LED3.A R3-C.2
N$4
  Top 0.127: LED2.A R2-C.2
N$5
  Top 0.127: LED1.A R1-C.2
N$6  (via drill 2.95)
  other vias: 22.86,48.26
N$7  (via drill 2.95)
  other vias: 2.54,48.26
N$8  (via drill 2.95)
  other vias: 2.54,2.54
N$9  (via drill 2.95)
  other vias: 22.86,2.54
N$10  (via drill 0.25)
  Bottom 0.254: U$1.+$1 20.9,32.12 21.02,32.25 R3.1
  other vias: 22.95,32.25
N$11  (via drill 0.25)
  Top 0.127: v15.45,3.87 R4-C1.2 | U$3.V- v8,11.17
  Top 0.254: U$6.2 v15.45,3.87
  Route2 0.127: v8,11.17 8.15,11.17
  Route2 0.254: 8.15,11.17 v15.45,3.87
N$12
  Top 0.254: U$4.4 1.97,15.62 C1-0S4.1
N$13
  Top 0.254: U$4.5 1.97,13.72 C1-0S4.2
N$14
  Top 0.127: R4-C1.1 16.5,2.92 14.7,2.92 13.65,1.88 LED5.C
N$15  (via drill 0.25)
  Top 0.127: v7.79,6.03 J1.1
  Bottom 0.127: 20.45,18.67 U$8.EXT_ANT
  Bottom 0.254: U$8.EXT_ANT 20.34,18.67 | U$8.EXT_ANT 20.45,18.42 | U$8.EXT_ANT 19.45,18.67 7.79,7.01 v7.79,6.03
N$16
  Top 0.254: U2-S.5 15.81,10.54 19.95,14.67 R5.2
NRST  (via drill 0.25, 1)
  Top 0.127: v23.49,36.83 21.9,38.42 20.5,38.42 C5-0C1.1 | v8.22,34.92 8.47,34.67 U0-C.7
  Route2 0.254: v1.27,35.56 1.9,34.92 v8.22,34.92
  Bottom 0.127: v8.22,34.92 8.96,35.67 22.33,35.67 v23.49,36.83
SCK-1V8  (via drill 0.25)
  Top 0.127: U1-S.23 v12.1,25.42
  Route15 0.254: v12.1,25.42 12.07,25.42 11.49,24.84 10.09,24.84 U13-S.4
  other vias: 8.41,26.52
SPI1_MISO  (via drill 0.25)
  Top 0.127: U0-C.16 11.45,29.92 10.95,29.42 10.95,27.17 11.6,26.52 U14-S.4 11.51,26.52 v11.45,26.59 | v18.45,25.17 20.95,25.17 21.82,24.3
  Top 0.254: U$7.P$6 21.82,24.3
  Route2 0.254: v18.45,25.17 14.02,25.17 12.61,26.59 v11.45,26.59
SPI1_MOSI  (via drill 0.25)
  Top 0.127: v12.7,29.22 11.95,29.97 U0-C.17 | v12.7,29.22 | v12.7,29.22 12.7,27.55 13.08,27.17 U12-S.2 v14.45,27.17
  Route2 0.254: v14.45,27.17 17.42,27.17 U$7.P$7
  other vias: 20.57,24.02
SPI1_SCK  (via drill 0.25)
  Top 0.127: U0-C.15 10.95,30.17 9.87,29.09 8.12,29.09 7.45,28.42 7.45,27.73 6.92,27.2 6.51,27.2 U13-S.2 6.08,27.17 5.7,26.8 5.7,26.17 v6.45,25.42
  Route15 0.254: v6.45,25.42 8.67,25.42 10.07,24.02 U$7.P$8
  other vias: 19.32,24.02
SPI2_MISO  (via drill 0.25, 1)
  Top 0.127: U0-C.27 v17.2,33.17
  Top 0.254: v5.71,45.72 6.87,46.87 9.19,46.87 U$2.2
  Route2 0.127: 5.84,45.72 v5.71,45.72
  Route2 0.254: v17.2,33.17 15.7,33.17 12.07,36.8 12.07,39.48 5.84,45.72
SPI2_MOSI  (via drill 0.25, 1)
  Top 0.127: U0-C.28 16.82,33.67 v17.2,34.05
  Route2 0.254: v8.25,45.72 8.89,45.08 U$2.5 17.74,34.59 v17.2,34.05
  other vias: 17.74,45.08
SPI2_SCK  (via drill 0.25, 1)
  Top 0.127: U0-C.26 16.82,32.67 v17.2,32.3
  Route2 0.254: v17.2,32.3 18.45,33.55 18.45,45.65 U$2.6 17.16,46.94 9.7,46.94 9.7,46.93 7.04,46.93 v5.71,48.26
  other vias: 17.74,46.35
ST-5V  (via drill 0.25)
  Top 0.127: 14.21,11.81 U2-S.4 v14.84,11.81 | U14-S2.4 v11.2,17.52
  Route2 0.254: v14.84,11.81 14.84,13.88 v11.2,17.52
STATUS-5V  (via drill 0.25)
  Top 0.127: 14.32,18.17 v14.26,18.17 U14-S1.2
  Top 0.254: U2-S.6 v14.26,9.27
  Route15 0.254: v14.26,9.27 v14.26,18.17
SWCLK  (via drill 0.25, 1)
  Top 0.127: 15.51,38.36 U0-C.37 v15.45,39.24
  Bottom 0.127: v20.95,39.37 20.82,39.24 v15.45,39.24
SWDIO  (via drill 1)
  Top 0.127: 16.45,36.67 U0-C.34 16.15,36.69 20.82,36.69 v20.95,36.83
SWO  (via drill 0.25, 1)
  Top 0.127: U0-C.39 14.45,38.99 v14.67,39.21
  Bottom 0.127: v14.67,39.21 14.75,39.21 15.53,38.42 22.55,38.42 v23.49,39.37
U1S-REGOUT
  Top 0.127: U1-S.10 12.9,20.97 14.12,19.75 C1-1S.1
USART2_RX  (via drill 0.25)
  Top 0.127: U0-C.13 9.95,31.17 v8.7,29.92
  Route2 0.254: v8.7,29.92 7.45,28.67 7.45,20.1 v4.47,17.12
  Bottom 0.254: U$8.TX 4.46,17.17 v4.47,17.12
USART2_TX  (via drill 0.25)
  Top 0.127: U0-C.12 9.26,31.99 v7.95,30.67
  Route2 0.254: v7.95,30.67 4.59,27.32 v4.59,18.67
  Bottom 0.254: U$8.RX v4.59,18.67
VBAT  (via drill 0.25)
  Top 0.127: U0-C.1 9.2,37.74 v9.2,38.17
  Route2 0.254: v4.42,31.59 2.2,29.37 2.2,12.17 U$8.VBACKUP
  Bottom 0.254: v9.2,38.17 4.5,33.47 U$1.+$2 v4.42,31.59
  other vias: 4.7,9.67
VBAT_MEAS  (via drill 0.25)
  Top 0.254: R4.1 21.84,29.24 | R3.2 21.84,29.24 | 21.84,29.24 v16.45,29.24 | v14.2,29.24 12.45,30.99 U0-C.18
  Bottom 0.254: v16.45,29.24 v14.2,29.24
VCAP
  Top 0.127: 14.45,31.17 U0-C.22 14.45,30.92 15.24,30.13 18.48,30.13 C1-0C.1
VREF+
  Top 0.127: U0-C.9 6.81,33.67 C2-0C.1 6.76,33.67 4.64,33.67 FB1-0C.1

### Text on the board
tNames: Storage | SCK | CS | SDA | MISO | MOSI | GND | SCL | 3V3 | SWCLK | SWO | SWDIO | BUZZER | NRST | BUTTON | NRST | GND | BATT_MEAS | MITCH 2021.0 | Purdue Space Program Solids | BMP | IMU | GPS Ant. | ALA normal to PCB
bNames: +Y | +X | MAG | +Z | ACCEL & GYRO | +Z | +X | +Y | Apply insulation / to shaded area | R1 | R2 | VDIV | BATT / MEAS | 12mm coin cell can be added / to help GPS acquire lock faster | R Horvath | B Elshimy | M Batistich | B Wodetzki | J Wiley | V Vijay | M Paral | J Kaji | Improper use may destroy this device. | Use provided voltage divider to protect the ADC. | WARNING: BATT_MEAS cannot exceed 3.3V | Purdue Space Program Solids | GPS | MITCH 2021.0